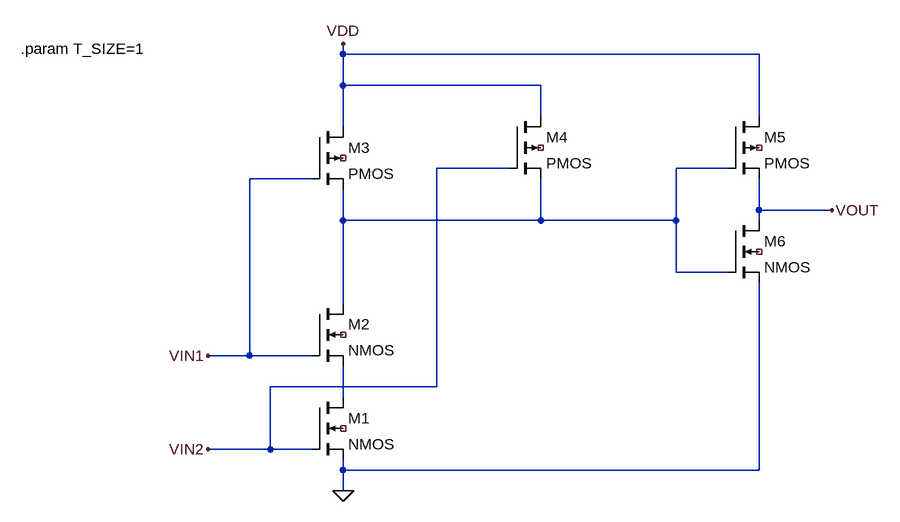
[diagram p0: schematic and.asc]
and.asc, the LTspice schematic file:
Version 4
SHEET 1 1124 680
WIRE 288 -336 288 -352
WIRE 928 -336 288 -336
WIRE 288 -288 288 -336
WIRE 592 -288 288 -288
WIRE 592 -240 592 -288
WIRE 928 -240 928 -336
WIRE 288 -224 288 -288
WIRE 544 -160 432 -160
WIRE 880 -160 800 -160
WIRE 240 -144 144 -144
WIRE 928 -96 928 -144
WIRE 1040 -96 928 -96
WIRE 288 -80 288 -128
WIRE 592 -80 592 -144
WIRE 592 -80 288 -80
WIRE 800 -80 800 -160
WIRE 800 -80 592 -80
WIRE 928 -80 928 -96
WIRE 800 0 800 -80
WIRE 880 0 800 0
WIRE 288 48 288 -80
WIRE 144 128 144 -144
WIRE 144 128 80 128
WIRE 240 128 144 128
WIRE 432 176 432 -160
WIRE 432 176 176 176
WIRE 288 192 288 144
WIRE 176 272 176 176
WIRE 176 272 80 272
WIRE 240 272 176 272
WIRE 288 304 288 288
WIRE 928 304 928 16
WIRE 928 304 288 304
WIRE 288 336 288 304
FLAG 80 128 VIN1
FLAG 80 272 VIN2
FLAG 288 336 0
FLAG 1040 -96 VOUT
FLAG 288 -352 VDD
SYMBOL nmos4 240 192 R0
SYMATTR InstName M1
SYMATTR Value2 l=90n w='(T_SIZE)*200n'
SYMBOL nmos4 240 48 R0
SYMATTR InstName M2
SYMATTR Value2 l=90n w='(T_SIZE)*200n'
SYMBOL pmos4 240 -224 R0
SYMATTR InstName M3
SYMATTR Value2 l=90n w='(T_SIZE)*400n'
SYMBOL pmos4 544 -240 R0
SYMATTR InstName M4
SYMATTR Value2 l=90n w='(T_SIZE)*400n'
SYMBOL pmos4 880 -240 R0
SYMATTR InstName M5
SYMATTR Value2 l=90n w='(T_SIZE)*400n'
SYMBOL nmos4 880 -80 R0
SYMATTR InstName M6
SYMATTR Value2 l=90n w='(T_SIZE)*200n'
TEXT -208 -344 Left 2 !.param T_SIZE=1

The netlist it stands for:
* and.asc
M1 N002 VIN2 0 NC_01 NMOS l=90n w='(T_SIZE)*200n'
M2 N001 VIN1 N002 NC_02 NMOS l=90n w='(T_SIZE)*200n'
M3 VDD VIN1 N001 NC_03 PMOS l=90n w='(T_SIZE)*400n'
M4 VDD VIN2 N001 NC_04 PMOS l=90n w='(T_SIZE)*400n'
M5 VDD N001 VOUT NC_05 PMOS l=90n w='(T_SIZE)*400n'
M6 VOUT N001 0 NC_06 NMOS l=90n w='(T_SIZE)*200n'
.model NMOS NMOS
.model PMOS PMOS
.lib standard.mos
.param T_SIZE=1
.backanno
.end